# EasyEDA schematic 4.27.json
TITLE: Sheet_1; REV: 1.0; Date: 2020-11-18; Sheet: 1/1; Drawn By: Gökbey Keskin; Company: Your Company
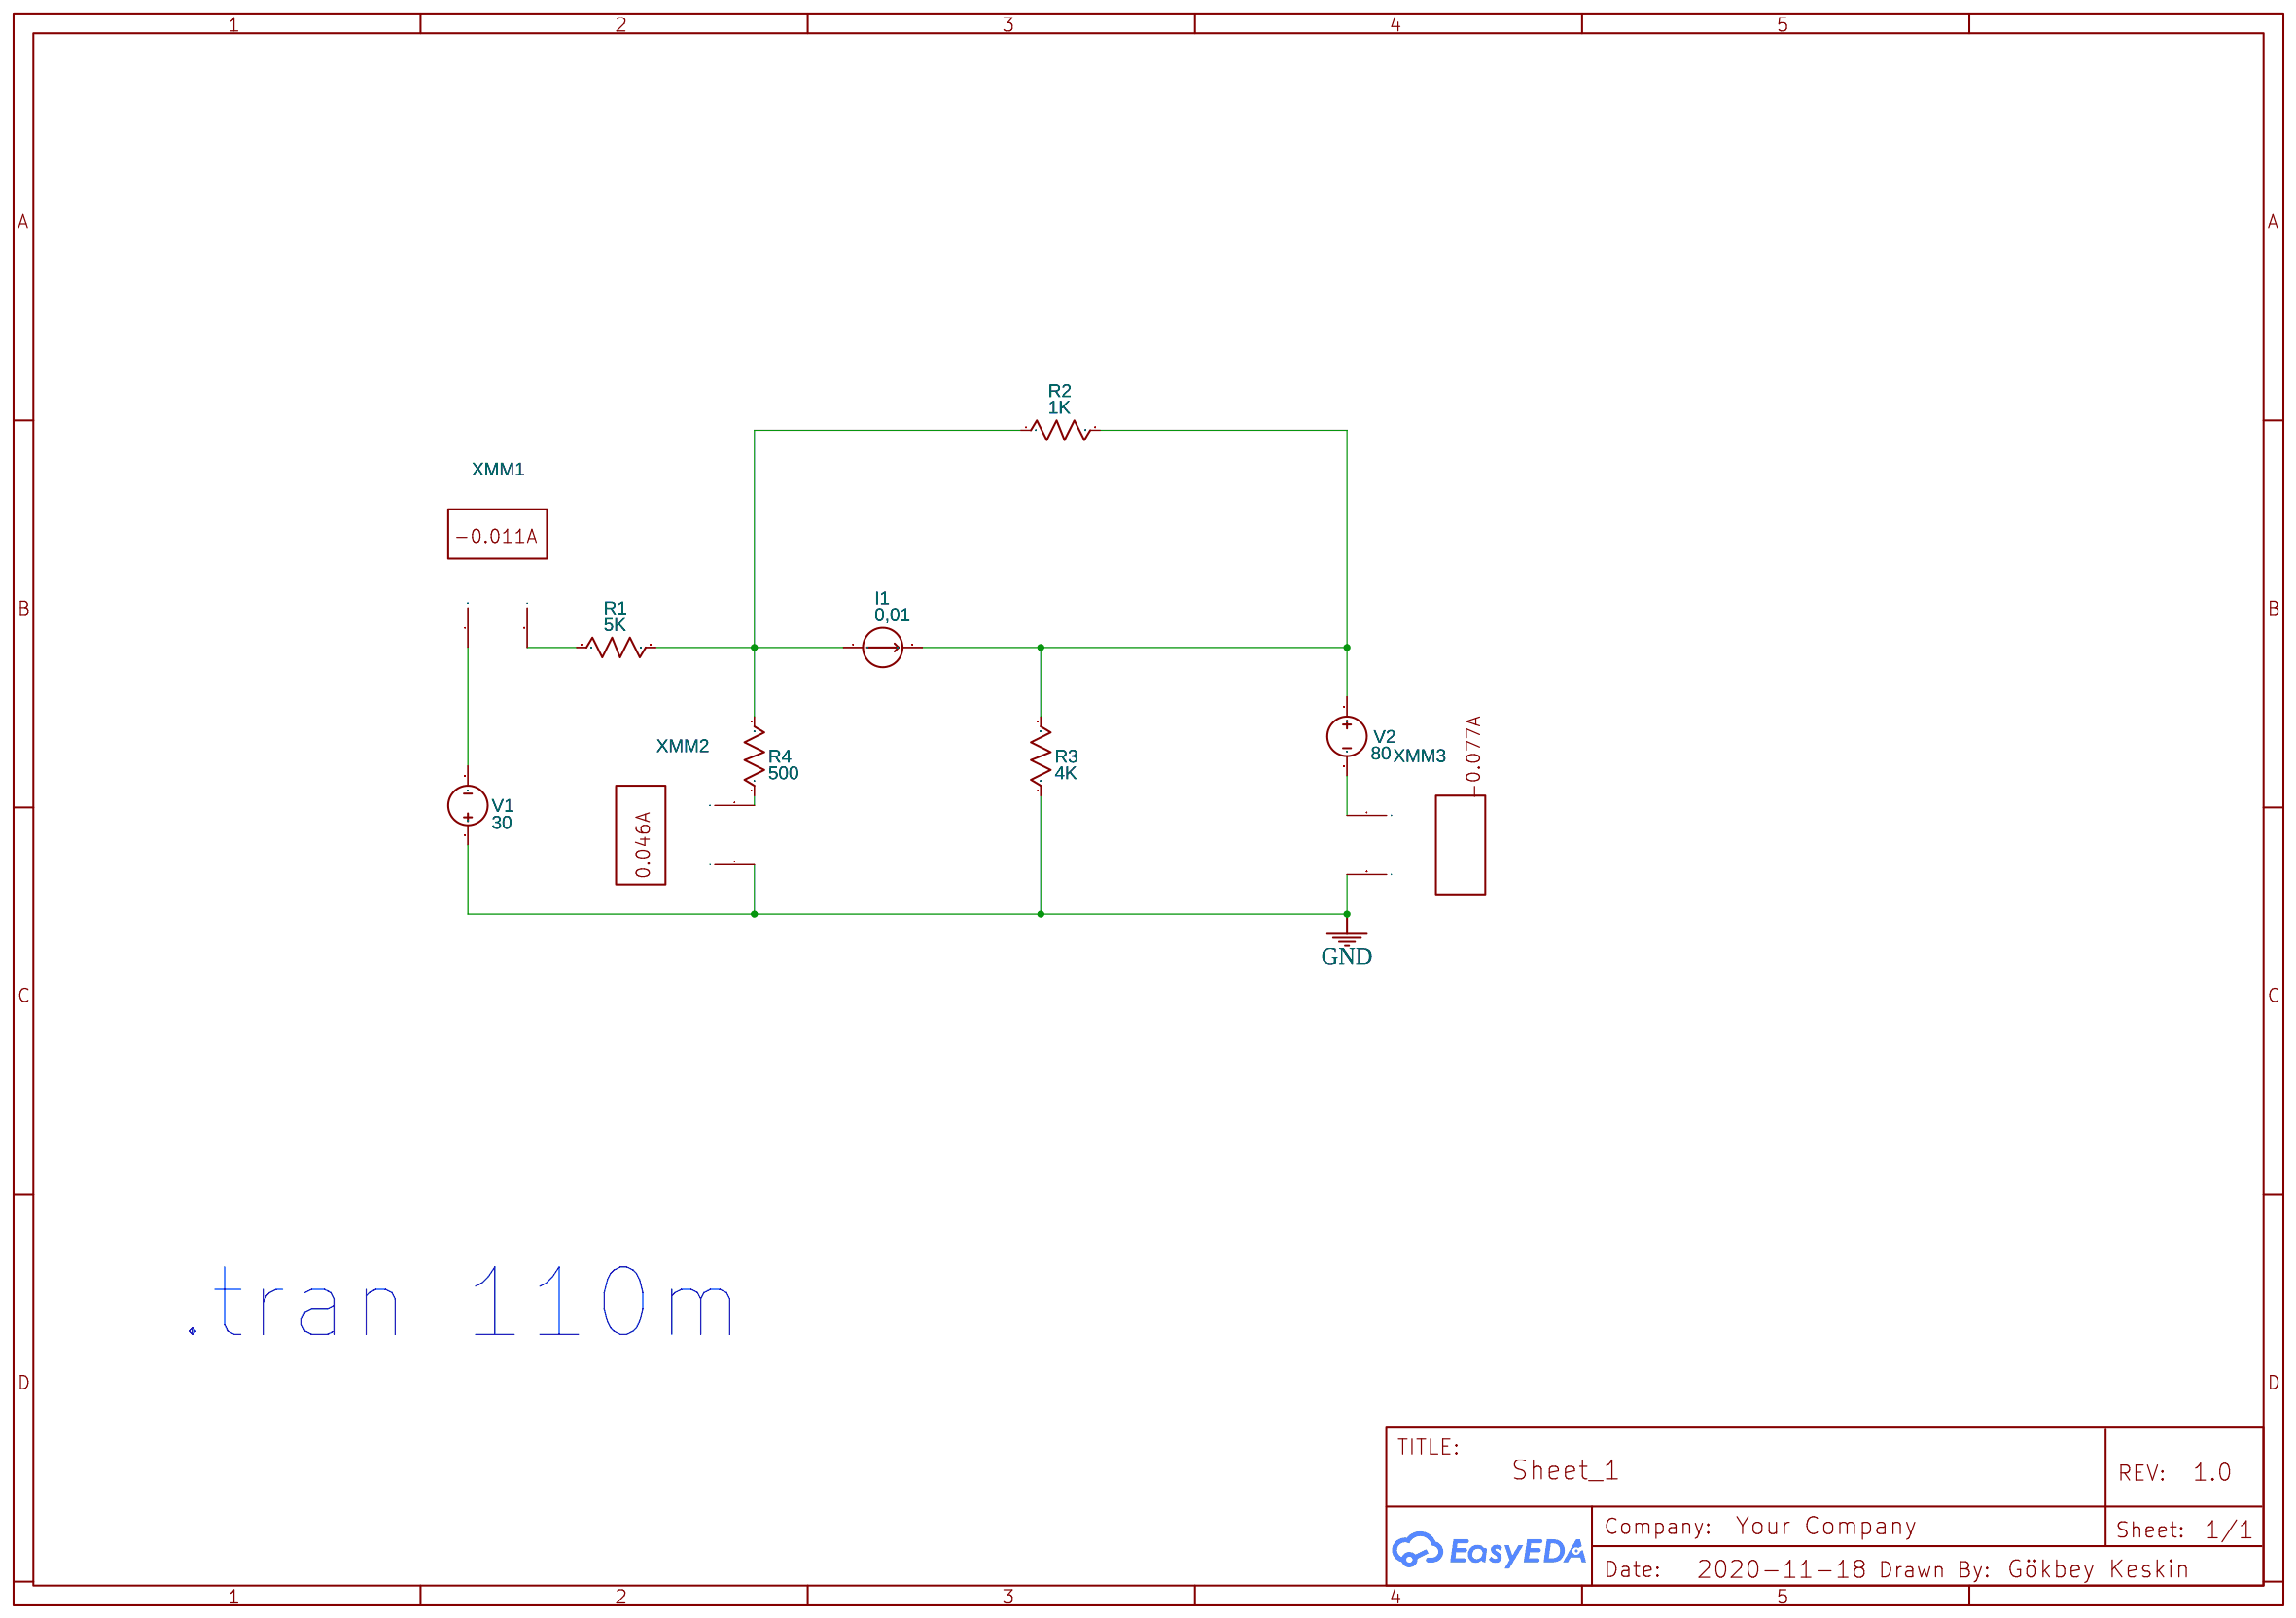
[diagram p0: schematic sheet]

## Parts
I1  0,01  [2P-5.08]
R1  5K  [AXIAL-0.3]
R2  1K  [AXIAL-0.3]
R3  4K  [AXIAL-0.3]
R4  500  [AXIAL-0.3]
V1  30  [HDR1X2]
V2  80  [HDR1X2]
XMM1  Multimeter
XMM2  Multimeter
XMM3  Multimeter

## Library data of the parts
I1 = IDC: Contributor: EasyEDA; sim: true
R1-R4 = Resistor_US: Resistance: 1k; Contributor: EasyEDA; Supplier: YUJING
V1 V2 = VDC: Contributor: EasyEDA; sim: true
XMM1-XMM3 = MULTIMETER: Supplier: LCSC; Multimeter Type: Amper; Power Type: AC; Voltmeter resistance: 10μ; Ammeter resistance: 1G; NameDisplay: 0; Contributor: EasyEDA; sim: true

## Nets
GND: R3.1 V1.1 XMM2.2(I) XMM3.2(I)
Net-(I1-1): I1.1 R1.2 R2.1 R4.2
Net-(I1-2): I1.2 R2.2 R3.2 V2.1
Net-(R1-1): R1.1 XMM1.2(I)
Net-(R4-1): R4.1 XMM2.1(+)
Net-(V1-2): V1.2 XMM1.1(+)
Net-(V2-2): V2.2 XMM3.1(+)

## Notes on the sheet
- .tran 110m
